# Altium project MU-RK3576J-MB.PrjPCB (part 13 of 13)
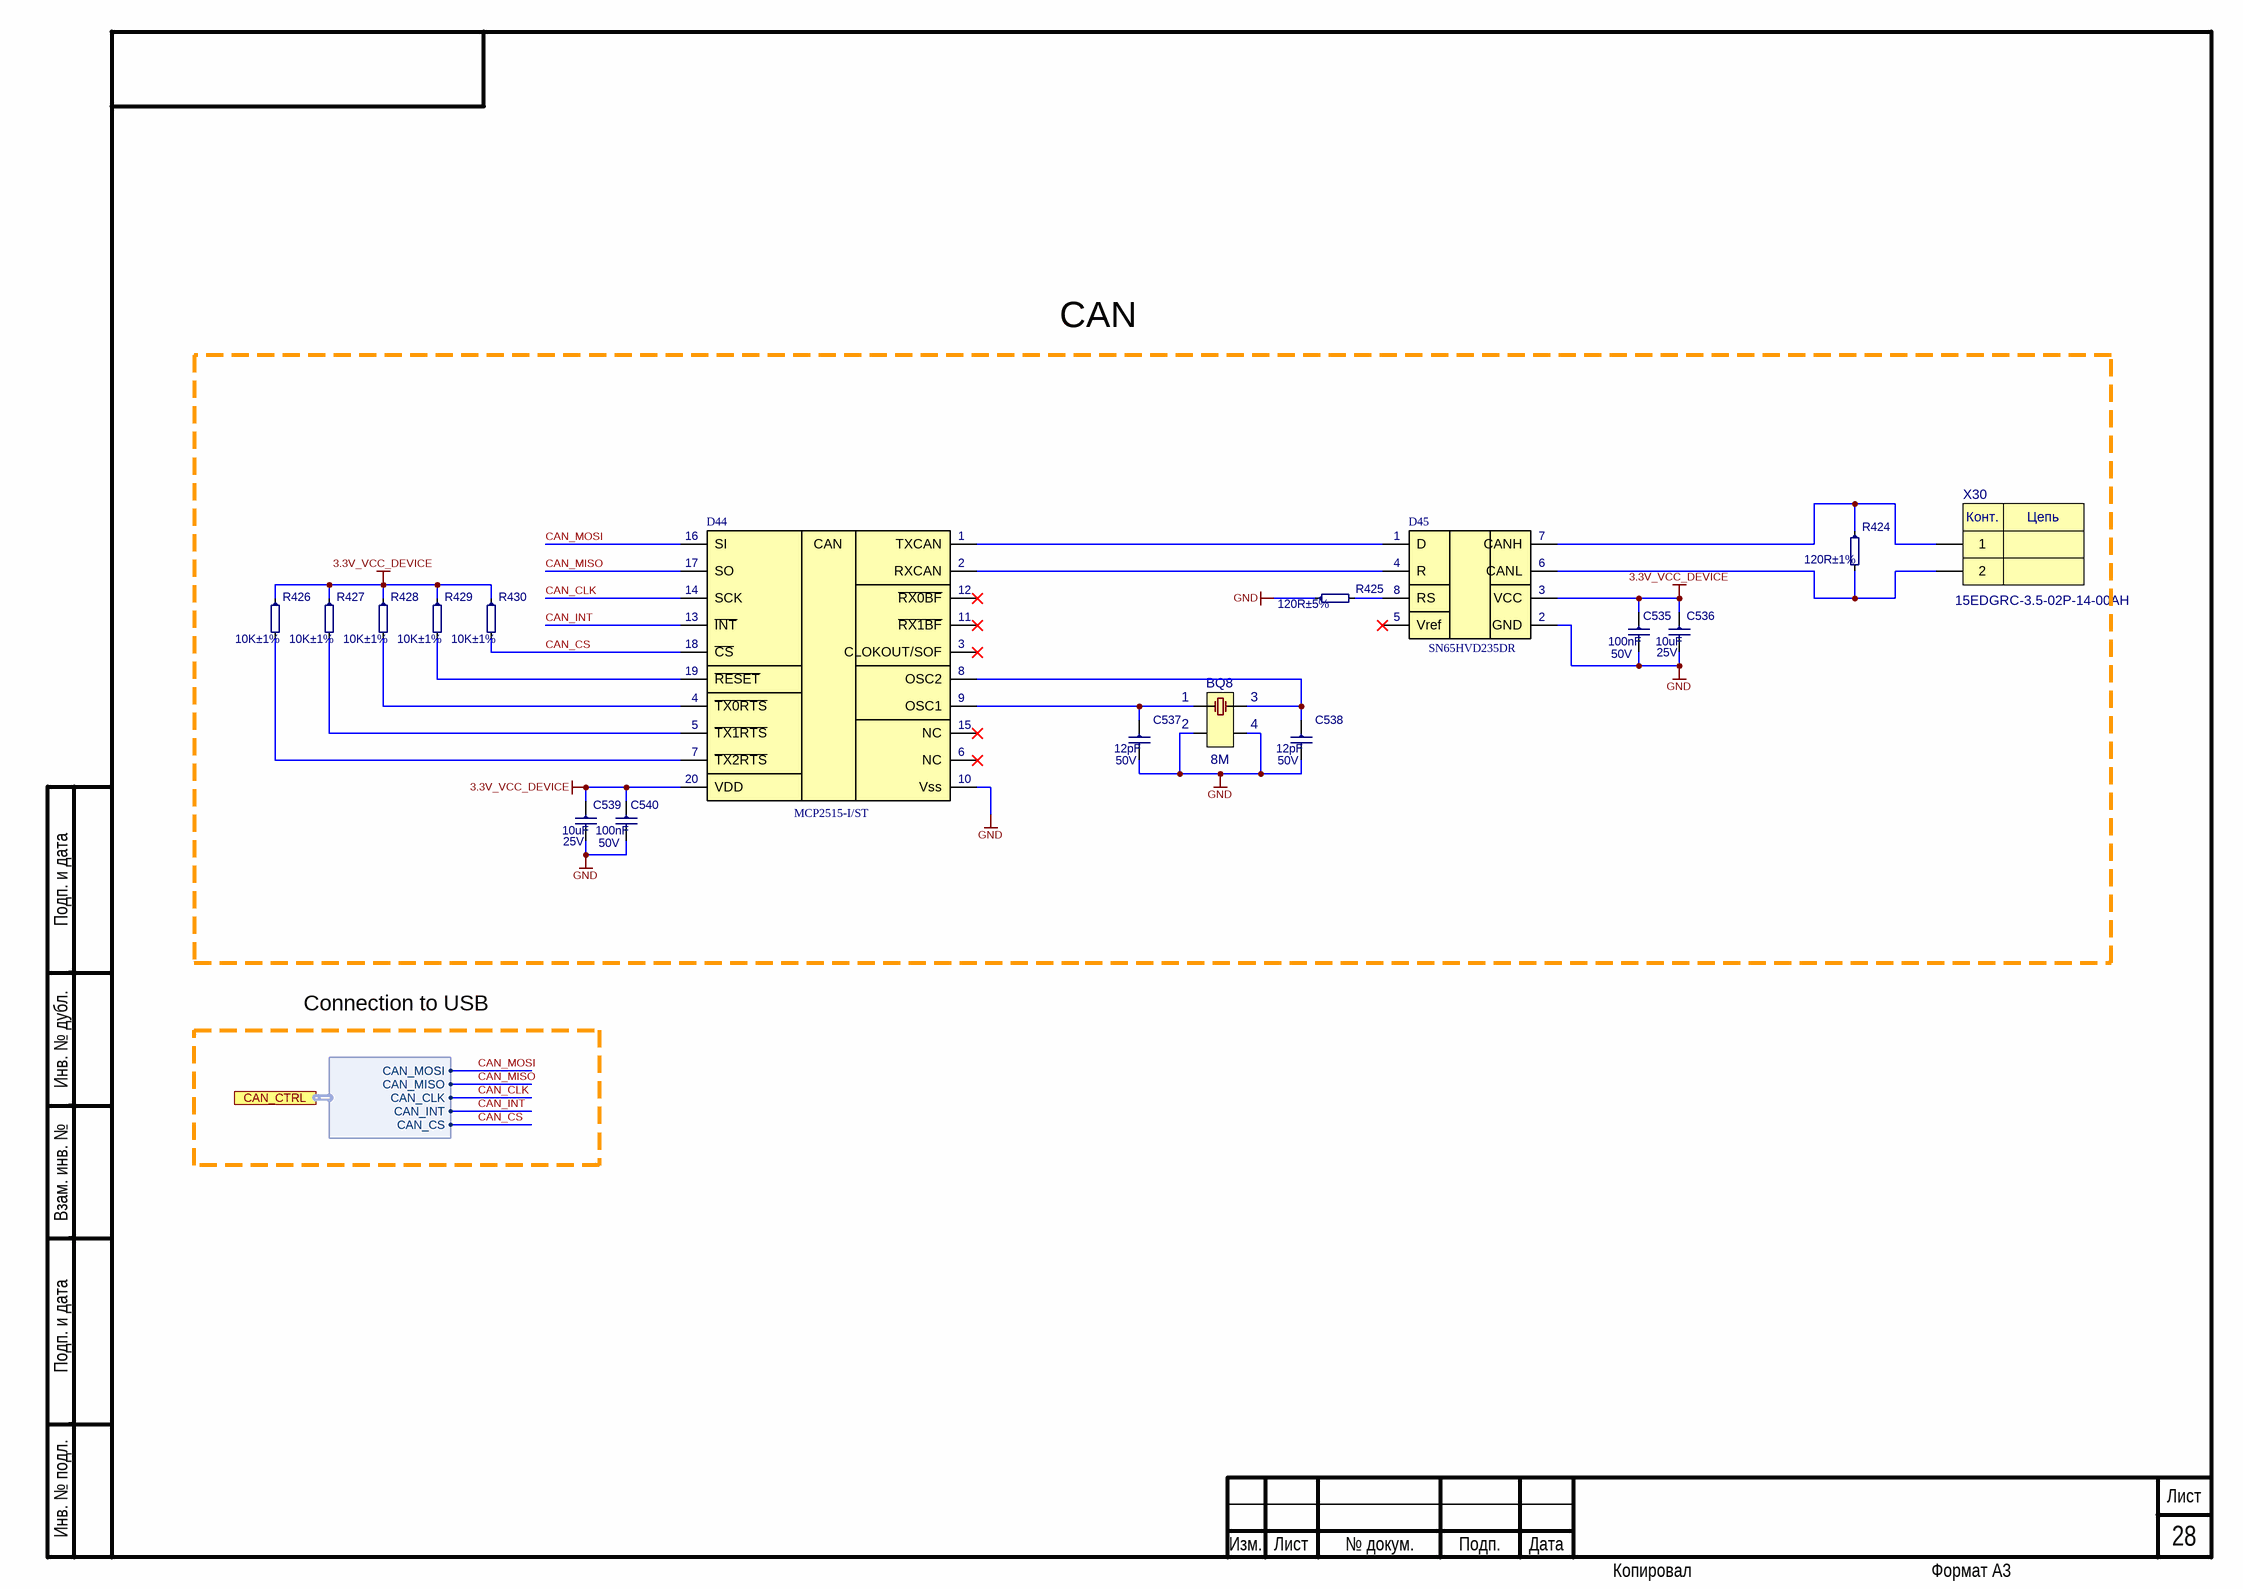
[diagram p134: CAN-FD.SchDoc]

## Nets that join several sheets
3.3V_VCC_DEVICE: PWR_MAIN (6 pins), LVDS_eDP (R241.1 R245.1 R405.1 VT7.2), INT_mPCIeX2_SIM (16 pins), CPU_PCIE_USB_HDMI_EXT_PCIEX2_mPCIeX2 (22 pins), AUDIO (15 pins), BMC (R268.1), CAN-FD (11 pins)
+1.2V_PCI: PWR_CORE (6 pins), CPU_PCIE_USB_HDMI_EXT_PCIEX2_mPCIeX2 (19 pins)
+1.5V_mPCIe: PWR_CORE (6 pins), INT_mPCIeX2_SIM (X7.6 X7.28 X7.48)
+3.3V_MCU: Flash_eMMC_MicroSD (14 pins), BMC (36 pins)
+12V_VCC_DEVICE: PWR_MAIN (6 pins), V-by-One (R472.1), LVDS_eDP (R243.1 R407.1), CPU_PCIE_USB_HDMI_EXT_PCIEX2_mPCIeX2 (16 pins), AUDIO (15 pins), BMC (R205.1), Peripheral (L17.1)
+VDC_IN_MAIN: PWR_DC_IN (14 pins), PWR_MAIN (26 pins), PWR_PoE_PD_1000BASE-T (VD49.1)
GND: PWR_DC_IN (40 pins), PWR_MAIN (69 pins), PWR_PMIC (59 pins), PWR_CPU (303 pins), PWR_PoE_PD_1000BASE-T (8 pins), PWR_CORE (56 pins), CPU_LPDDR4 (9 pins), CPU_GPIO (21 pins), IC_LPDDR4 (91 pins), Flash_eMMC_MicroSD (47 pins), HDMI (19 pins), CPU_MIPI_DSI_CSI (18 pins), V-by-One (86 pins), LVDS_eDP (27 pins), MIPI_x2CSI (18 pins), INT_mPCIeX2_SIM (56 pins), CPU_PCIE_USB_HDMI_EXT_PCIEX2_mPCIeX2 (97 pins), USB (21 pins), AUDIO (58 pins), BMC (62 pins), WIRELESS (28 pins), RGMII0_ETH_PHY (29 pins), CPU_ETH_RGMII1_SW (9 pins), Peripheral (45 pins), CAN-FD (11 pins)
SH: PWR_PoE_PD_1000BASE-T (10 pins), HDMI (C252.2 R105.2), INT_mPCIeX2_SIM (C282.2 C283.2 R143.2 R144.2), USB (C236.2 R95.2), Peripheral (C416.2 R112.2)
VCC1V1_RK628_HDMIRX: PWR_CORE (7 pins), V-by-One (C559.2 D47.D8 D47.E9)
VCC3V3_RK628_HDMIRX: PWR_CORE (L34.1 R369.2), V-by-One (C558.2 D47.H5 R444.1)
VCC5V0_DEVICE_S0: PWR_MAIN (6 pins), HDMI (5 pins), LVDS_eDP (R242.1 R406.1), CPU_PCIE_USB_HDMI_EXT_PCIEX2_mPCIeX2 (C585.2 D42.9 R438.2), USB (C231.2 C239.2 D15.5 D16.12), BMC (R203.1), Peripheral (VD43.2)
VCC5V0_SYS_S5: PWR_DC_IN (VT14.3), PWR_MAIN (7 pins), PWR_PMIC (28 pins), PWR_CORE (13 pins), BMC (C436.2 D30.1 D30.3 R270.1), Peripheral (R418.2)
VCC_1V1_NLDO_S3: PWR_PMIC (C83.1 C89.1 D3.9 D3.13), PWR_CORE (6 pins)
VCC_1V8_S0: PWR_CORE (C502.1 R367.1 VT27.2), CPU_ETH_RGMII1_SW (C542.2 D2.2A4 D2.2A5)
VCC_1V8_S3: PWR_MAIN (R53.2), PWR_PMIC (C106.1 C107.1 D3.5 L7.1), PWR_CORE (C501.1 VT27.3), CPU_GPIO (8 pins), IC_LPDDR4 (R6.1), Flash_eMMC_MicroSD (R64.2), BMC (C586.1 D43.OE D43.VCCA), WIRELESS (13 pins), CPU_ETH_RGMII1_SW (C546.2 D2.2B10)
VCC_2V0_PLDO_S3: PWR_PMIC (C59.1 D3.59), PWR_CORE (6 pins)
VCC_3V3_S0: PWR_MAIN (R38.1 R49.1 R60.1), PWR_CORE (C505.1 C506.1 D39.1), CPU_GPIO (C260.2 D2.2N3 R189.2 R191.2), HDMI (5 pins), MIPI_x2CSI (X22.22 X23.22), CPU_PCIE_USB_HDMI_EXT_PCIEX2_mPCIeX2 (C323.2 D2.2P7), BMC (R269.1), RGMII0_ETH_PHY (R293.1), CPU_ETH_RGMII1_SW (6 pins), Peripheral (HL10.2)
VCC_3V3_S3: PWR_MAIN (R54.1 R55.2 R56.2 VD7.2), PWR_PMIC (C108.1 C109.1 D3.24 L8.2), PWR_PoE_PD_1000BASE-T (R345.1), PWR_CORE (10 pins), CPU_GPIO (7 pins), Flash_eMMC_MicroSD (10 pins), WIRELESS (6 pins), CPU_ETH_RGMII1_SW (5 pins), Peripheral (7 pins)
VCCA1V1_RK628_HDMIRX: PWR_CORE (C511.1 L33.2), V-by-One (19 pins)
VCCA1V8_PLDO2_S0: PWR_PMIC (C61.2 D3.58), CPU_GPIO (C578.2 D2.2A10), Peripheral (5 pins)
VCCA3V3_RK628_HDMIRX: PWR_CORE (C519.1 L34.2), V-by-One (13 pins)
VCCA_1V8_S0: PWR_PMIC (C60.2 D3.60 R232.2), PWR_CPU (6 pins), CPU_LPDDR4 (C50.2 D2.2D2), CPU_GPIO (6 pins), CPU_MIPI_DSI_CSI (6 pins), CPU_PCIE_USB_HDMI_EXT_PCIEX2_mPCIeX2 (14 pins)
VCCIO_SD_S0: PWR_PMIC (C74.2 D3.65), CPU_GPIO (C259.2 D2.2A8)
VDD2_DDR_S3: PWR_PMIC (6 pins), IC_LPDDR4 (41 pins)
VDD_0V75_S3: PWR_PMIC (C84.2 D3.14), CPU_GPIO (C264.2 D2.2L2 D2.2L10)
VDD_CPU_BIG_S0: PWR_PMIC (7 pins), PWR_CPU (15 pins)
VDD_CPU_LIT_S0: PWR_PMIC (6 pins), PWR_CPU (9 pins)
VDD_DDR_S0: PWR_PMIC (6 pins), CPU_LPDDR4 (7 pins)
VDD_GPU_S0: PWR_PMIC (7 pins), PWR_CPU (9 pins)
VDD_LOGIC_S0: PWR_PMIC (7 pins), PWR_CPU (17 pins)
VDD_NPU_S0: PWR_PMIC (7 pins), PWR_CPU (9 pins)
VDDA_0V75_S0: PWR_PMIC (C95.2 D3.8), PWR_CPU (C154.2 D2.2G11), CPU_GPIO (C579.2 D2.2H11), CPU_MIPI_DSI_CSI (8 pins), CPU_PCIE_USB_HDMI_EXT_PCIEX2_mPCIeX2 (C320.2 D2.2P5)
VDDA_0V85_S0: PWR_PMIC (C90.2 D3.10), CPU_PCIE_USB_HDMI_EXT_PCIEX2_mPCIeX2 (7 pins)
VDDA_1V2_S0: PWR_PMIC (C69.2 D3.57), CPU_GPIO (C255.2 D2.2M3), CPU_MIPI_DSI_CSI (C402.1 D2.2M8)
VDDA_DDR_PLL_S0: PWR_PMIC (C85.2 D3.12), CPU_LPDDR4 (C49.2 D2.2C3)
VDDA_HDMI_S0: PWR_PMIC (C86.2 D3.11), CPU_PCIE_USB_HDMI_EXT_PCIEX2_mPCIeX2 (C327.2 C328.1 D2.2N11 D2.2P11)
VDDQ_DDR_CKE_S3: CPU_LPDDR4 (C51.2 D2.2B2), IC_LPDDR4 (R488.2)
VDDQ_DDR_S0: PWR_PMIC (6 pins), CPU_LPDDR4 (14 pins), IC_LPDDR4 (R4.1)
+5V_ON_OFF: PWR_DC_IN (R151.1), BMC (D28.66)
A_DRAM_CA0: CPU_LPDDR4 (D2.T1), IC_LPDDR4 (D1.H2)
A_DRAM_CA1: CPU_LPDDR4 (D2.1N1), IC_LPDDR4 (D1.J2)
A_DRAM_CA2: CPU_LPDDR4 (D2.1R3), IC_LPDDR4 (D1.H9)
A_DRAM_CA3: CPU_LPDDR4 (D2.1T2), IC_LPDDR4 (D1.H10)
A_DRAM_CA4: CPU_LPDDR4 (D2.1M5), IC_LPDDR4 (D1.H11)
A_DRAM_CA5: CPU_LPDDR4 (D2.1P5), IC_LPDDR4 (D1.J11)
A_DRAM_CKE0: CPU_LPDDR4 (D2.1N3), IC_LPDDR4 (D1.J4)
A_DRAM_CKE1: CPU_LPDDR4 (D2.1N5), IC_LPDDR4 (D1.J5)
A_DRAM_CLK_N: CPU_LPDDR4 (D2.P1), IC_LPDDR4 (D1.J9)
A_DRAM_CLK_P: CPU_LPDDR4 (D2.1L1), IC_LPDDR4 (D1.J8)
A_DRAM_CS0: CPU_LPDDR4 (D2.1R4), IC_LPDDR4 (D1.H4)
A_DRAM_CS1: CPU_LPDDR4 (D2.1T4), IC_LPDDR4 (D1.H3)
A_DRAM_DATA0: CPU_LPDDR4 (D2.W1), IC_LPDDR4 (D1.B2)
A_DRAM_DATA1: CPU_LPDDR4 (D2.1T1), IC_LPDDR4 (D1.C2)
A_DRAM_DATA2: CPU_LPDDR4 (D2.1P1), IC_LPDDR4 (D1.E2)
A_DRAM_DATA3: CPU_LPDDR4 (D2.U1), IC_LPDDR4 (D1.F2)
A_DRAM_DATA4: CPU_LPDDR4 (D2.1V3), IC_LPDDR4 (D1.F4)
A_DRAM_DATA5: CPU_LPDDR4 (D2.1W4), IC_LPDDR4 (D1.E4)
A_DRAM_DATA6: CPU_LPDDR4 (D2.AC1), IC_LPDDR4 (D1.C4)
A_DRAM_DATA7: CPU_LPDDR4 (D2.AB1), IC_LPDDR4 (D1.B4)
A_DRAM_DATA8: CPU_LPDDR4 (D2.AF1), IC_LPDDR4 (D1.B11)
A_DRAM_DATA9: CPU_LPDDR4 (D2.1AB1), IC_LPDDR4 (D1.C11)
A_DRAM_DATA10: CPU_LPDDR4 (D2.1AD1), IC_LPDDR4 (D1.E11)
A_DRAM_DATA11: CPU_LPDDR4 (D2.AH1), IC_LPDDR4 (D1.F11)
A_DRAM_DATA12: CPU_LPDDR4 (D2.1Y1), IC_LPDDR4 (D1.F9)
A_DRAM_DATA13: CPU_LPDDR4 (D2.1W2), IC_LPDDR4 (D1.E9)
A_DRAM_DATA14: CPU_LPDDR4 (D2.1AA3), IC_LPDDR4 (D1.C9)
A_DRAM_DATA15: CPU_LPDDR4 (D2.1AA1), IC_LPDDR4 (D1.B9)
A_DRAM_DATALINE.A_DRAM_DMI0: CPU_LPDDR4 (D2.1V1), IC_LPDDR4 (D1.C3)
A_DRAM_DATALINE.A_DRAM_DMI1: CPU_LPDDR4 (D2.AE1), IC_LPDDR4 (D1.C10)
A_DRAM_DATALINE.A_DRAM_DQS0_N: CPU_LPDDR4 (D2.Y1), IC_LPDDR4 (D1.E3)
A_DRAM_DATALINE.A_DRAM_DQS0_P: CPU_LPDDR4 (D2.1U1), IC_LPDDR4 (D1.D3)
A_DRAM_DATALINE.A_DRAM_DQS1_N: CPU_LPDDR4 (D2.1AB3), IC_LPDDR4 (D1.E10)
A_DRAM_DATALINE.A_DRAM_DQS1_P: CPU_LPDDR4 (D2.1AB4), IC_LPDDR4 (D1.D10)
AMP_CTRL.AMP_MUTE: AUDIO (R228.2), CPU_ETH_RGMII1_SW (D2.1D13)
AMP_CTRL.AMP_RST: AUDIO (R217.1 R218.1), CPU_ETH_RGMII1_SW (D2.B6)
ASM_I2C.RK_ASM_I2C_SCL: CPU_PCIE_USB_HDMI_EXT_PCIEX2_mPCIeX2 (X19.A2), CPU_ETH_RGMII1_SW (D2.1A24)
ASM_I2C.RK_ASM_I2C_SDA: CPU_PCIE_USB_HDMI_EXT_PCIEX2_mPCIeX2 (X19.A3), CPU_ETH_RGMII1_SW (D2.C28)
B_DRAM_CA0: CPU_LPDDR4 (D2.L1), IC_LPDDR4 (D1.R2)
B_DRAM_CA1: CPU_LPDDR4 (D2.1J1), IC_LPDDR4 (D1.P2)
B_DRAM_CA2: CPU_LPDDR4 (D2.1J3), IC_LPDDR4 (D1.R9)
B_DRAM_CA3: CPU_LPDDR4 (D2.1G2), IC_LPDDR4 (D1.R10)
B_DRAM_CA4: CPU_LPDDR4 (D2.1F4), IC_LPDDR4 (D1.R11)
B_DRAM_CA5: CPU_LPDDR4 (D2.1K5), IC_LPDDR4 (D1.P11)
B_DRAM_CKE0: CPU_LPDDR4 (D2.1K2), IC_LPDDR4 (D1.P4)
B_DRAM_CKE1: CPU_LPDDR4 (D2.1M3), IC_LPDDR4 (D1.P5)
B_DRAM_CLK_N: CPU_LPDDR4 (D2.N1), IC_LPDDR4 (D1.P9)
B_DRAM_CLK_P: CPU_LPDDR4 (D2.1K1), IC_LPDDR4 (D1.P8)
B_DRAM_CS0: CPU_LPDDR4 (D2.1J5), IC_LPDDR4 (D1.R4)
B_DRAM_CS1: CPU_LPDDR4 (D2.1K4), IC_LPDDR4 (D1.R3)
B_DRAM_DATA0: CPU_LPDDR4 (D2.1D2), IC_LPDDR4 (D1.AA2)
B_DRAM_DATA1: CPU_LPDDR4 (D2.1F2), IC_LPDDR4 (D1.Y2)
B_DRAM_DATA2: CPU_LPDDR4 (D2.1G1), IC_LPDDR4 (D1.V2)
B_DRAM_DATA3: CPU_LPDDR4 (D2.K1), IC_LPDDR4 (D1.U2)
B_DRAM_DATA4: CPU_LPDDR4 (D2.1C3), IC_LPDDR4 (D1.U4)
B_DRAM_DATA5: CPU_LPDDR4 (D2.1B3), IC_LPDDR4 (D1.V4)
B_DRAM_DATA6: CPU_LPDDR4 (D2.A5), IC_LPDDR4 (D1.Y4)
B_DRAM_DATA7: CPU_LPDDR4 (D2.G1), IC_LPDDR4 (D1.AA4)
B_DRAM_DATA8: CPU_LPDDR4 (D2.1A1), IC_LPDDR4 (D1.AA11)
B_DRAM_DATA9: CPU_LPDDR4 (D2.B1), IC_LPDDR4 (D1.Y11)
B_DRAM_DATA10: CPU_LPDDR4 (D2.B2), IC_LPDDR4 (D1.V11)
B_DRAM_DATA11: CPU_LPDDR4 (D2.A2), IC_LPDDR4 (D1.U11)
B_DRAM_DATA12: CPU_LPDDR4 (D2.1E1), IC_LPDDR4 (D1.U9)
B_DRAM_DATA13: CPU_LPDDR4 (D2.1C1), IC_LPDDR4 (D1.V9)
B_DRAM_DATA14: CPU_LPDDR4 (D2.E1), IC_LPDDR4 (D1.Y9)
B_DRAM_DATA15: CPU_LPDDR4 (D2.D1), IC_LPDDR4 (D1.AA9)
B_DRAM_DATALINE.B_DRAM_DMI0: CPU_LPDDR4 (D2.B4), IC_LPDDR4 (D1.Y3)
B_DRAM_DATALINE.B_DRAM_DMI1: CPU_LPDDR4 (D2.1B1), IC_LPDDR4 (D1.Y10)
B_DRAM_DATALINE.B_DRAM_DQS0_N: CPU_LPDDR4 (D2.1F1), IC_LPDDR4 (D1.V3)
B_DRAM_DATALINE.B_DRAM_DQS0_P: CPU_LPDDR4 (D2.H1), IC_LPDDR4 (D1.W3)
B_DRAM_DATALINE.B_DRAM_DQS1_N: CPU_LPDDR4 (D2.B3), IC_LPDDR4 (D1.V10)
B_DRAM_DATALINE.B_DRAM_DQS1_P: CPU_LPDDR4 (D2.A3), IC_LPDDR4 (D1.W10)
BMC_UART.BMC_UART_RX: BMC (D43.A1), CPU_ETH_RGMII1_SW (D2.C29)
BMC_UART.BMC_UART_TX: BMC (D43.A2), CPU_ETH_RGMII1_SW (D2.1D22)
BT_EN_HOST: WIRELESS (R397.1), CPU_ETH_RGMII1_SW (D2.1C22)
BT_UART.BT_UART_CTS: WIRELESS (A2.41), CPU_ETH_RGMII1_SW (D2.1C23)
BT_UART.BT_UART_RTS: WIRELESS (A2.44), CPU_ETH_RGMII1_SW (D2.B29)
BT_UART.BT_UART_RX: WIRELESS (A2.42), CPU_ETH_RGMII1_SW (D2.B28)
BT_UART.BT_UART_TX: WIRELESS (A2.43), CPU_ETH_RGMII1_SW (D2.1B23)
BT_WAKE: CPU_GPIO (D2.1P23), WIRELESS (R399.2 VT33.3)
CAN_CLK: CPU_ETH_RGMII1_SW (D2.1E12), CAN-FD (D44.14)
CAN_CS: CPU_ETH_RGMII1_SW (D2.1E7), CAN-FD (D44.18 R430.2)
CAN_CTRL.CAN_INT: CPU_ETH_RGMII1_SW (D2.1B7), CAN-FD (D44.13)
CAN_CTRL.CAN_MISO: CPU_ETH_RGMII1_SW (D2.1D10), CAN-FD (D44.17)
CAN_CTRL.CAN_MOSI: CPU_ETH_RGMII1_SW (D2.1C10), CAN-FD (D44.16)
DAC_CTRL.I2S_BCK: AUDIO (D23.21), CPU_ETH_RGMII1_SW (D2.1D6)
DAC_CTRL.I2S_LRCK: AUDIO (D23.23), CPU_ETH_RGMII1_SW (D2.1B6)
DAC_CTRL.I2S_OUT: AUDIO (D23.22), CPU_ETH_RGMII1_SW (D2.A7)
DAC_CTRL.I2S_SCK: AUDIO (R206.1), CPU_ETH_RGMII1_SW (D2.1C6)
DAC_CTRL.PCM_I2C_SCL: AUDIO (D23.12 R195.2), CPU_ETH_RGMII1_SW (D2.1A4)
DAC_CTRL.PCM_I2C_SDA: AUDIO (D23.11 R196.2), CPU_ETH_RGMII1_SW (D2.B8)
DEBUG.UART0_RX_M0_DEBUG: CPU_GPIO (R244.1), Peripheral (D26.8)
DEBUG.UART0_TX_M0_DEBUG: CPU_GPIO (R238.1), Peripheral (D26.9)
DRAM_ADDR_CTRL_CK.DRAM_RESETn: CPU_LPDDR4 (D2.1U5), IC_LPDDR4 (D1.T11 R2.1)
DWLD_DIS.eMMC_FSPI_DIS: Flash_eMMC_MicroSD (R68.2), BMC (D28.80)
EDP_BL_EN: CPU_GPIO (D2.1Y22), LVDS_eDP (X29.27)
EDP_BL_PWM: CPU_GPIO (D2.1AA23), LVDS_eDP (X29.28)
EDP_CTRL.EDP_HPD: CPU_GPIO (D2.AC28), LVDS_eDP (X29.22)
EDP_CTRL.EDP_VCC_EN: CPU_GPIO (D2.1W23), LVDS_eDP (R246.1)
EEPROM_CTRL.I2C6_SCL_M3: CPU_GPIO (D2.1AE1), Flash_eMMC_MicroSD (D14.1 R82.2)
EEPROM_CTRL.I2C6_SDA_M3: CPU_GPIO (D2.AJ1), Flash_eMMC_MicroSD (D14.3 R81.2)
EEPROM_WP.EEPROM_WP_MCU_0: Flash_eMMC_MicroSD (R84.1 R87.2 VT3.2), BMC (D28.85)
EEPROM_WP.EEPROM_WP_MCU_1: Flash_eMMC_MicroSD (R86.2), BMC (D28.86)
eMMC_CLKOUT: CPU_GPIO (D2.1G23), Flash_eMMC_MicroSD (R66.1)
eMMC_CMD: CPU_GPIO (D2.1F22), Flash_eMMC_MicroSD (D12.M5 R65.2)
eMMC_D0: CPU_GPIO (D2.E28), Flash_eMMC_MicroSD (D12.A3 R63.2 VT1.3)
eMMC_D1: CPU_GPIO (D2.E29), Flash_eMMC_MicroSD (D12.A4)
eMMC_D2: CPU_GPIO (D2.1C24), Flash_eMMC_MicroSD (D12.A5)
eMMC_D3: CPU_GPIO (D2.F28), Flash_eMMC_MicroSD (D12.B2)
eMMC_D4: CPU_GPIO (D2.1D24), Flash_eMMC_MicroSD (D12.B3)
eMMC_D5: CPU_GPIO (D2.G28), Flash_eMMC_MicroSD (D12.B4)
eMMC_D6: CPU_GPIO (D2.D28), Flash_eMMC_MicroSD (D12.B5)
eMMC_D7: CPU_GPIO (D2.1B24), Flash_eMMC_MicroSD (D12.B6)
eMMC_DATA_STROBE: CPU_GPIO (D2.1F23), Flash_eMMC_MicroSD (D12.H5 R70.1)
eMMC_RSTn: CPU_GPIO (D2.1D23), Flash_eMMC_MicroSD (D12.K5 R67.2)
EN_MUX_GMAC1: BMC (D28.81), CPU_ETH_RGMII1_SW (D46.2 R439.1)
FAN_PWM: CPU_GPIO (D2.AK1), Peripheral (R237.1)
GMAC0_RXCLK: RGMII0_ETH_PHY (R303.2), CPU_ETH_RGMII1_SW (D2.1A12)
GMAC0_RXD0: RGMII0_ETH_PHY (R294.2), CPU_ETH_RGMII1_SW (D2.A13)
GMAC0_RXD1: RGMII0_ETH_PHY (R297.2), CPU_ETH_RGMII1_SW (D2.1A11)
GMAC0_RXD2: RGMII0_ETH_PHY (R300.2), CPU_ETH_RGMII1_SW (D2.B12)
GMAC0_RXD3: RGMII0_ETH_PHY (R302.2), CPU_ETH_RGMII1_SW (D2.1A10)
GMAC0_RXDV_CRS: RGMII0_ETH_PHY (R304.2), CPU_ETH_RGMII1_SW (D2.B13)
GMAC0_TXCLK: RGMII0_ETH_PHY (R316.2), CPU_ETH_RGMII1_SW (D2.B11)
GMAC0_TXD0: RGMII0_ETH_PHY (R309.2), CPU_ETH_RGMII1_SW (D2.1A9)
GMAC0_TXD1: RGMII0_ETH_PHY (R310.2), CPU_ETH_RGMII1_SW (D2.B10)
GMAC0_TXD2: RGMII0_ETH_PHY (R311.2), CPU_ETH_RGMII1_SW (D2.1A8)
GMAC0_TXD3: RGMII0_ETH_PHY (R314.2), CPU_ETH_RGMII1_SW (D2.B9)
GMAC0_TXEN: RGMII0_ETH_PHY (R315.2), CPU_ETH_RGMII1_SW (D2.A11)
GMAC1_MD.GMAC1_MDC: CPU_PCIE_USB_HDMI_EXT_PCIEX2_mPCIeX2 (X17.26 X18.B8), CPU_ETH_RGMII1_SW (R437.1)
GMAC1_MD.GMAC1_MDIO: CPU_PCIE_USB_HDMI_EXT_PCIEX2_mPCIeX2 (X17.24 X18.B9), CPU_ETH_RGMII1_SW (D2.1B15)
GMAC1_MD.PHY1_RSTn: CPU_PCIE_USB_HDMI_EXT_PCIEX2_mPCIeX2 (X17.20 X18.B10), CPU_ETH_RGMII1_SW (D2.A19)
GPS_CTRL.GPS_MODE: WIRELESS (R379.2), CPU_ETH_RGMII1_SW (D2.B19)
GPS_CTRL.GPS_ON: WIRELESS (R384.1), CPU_ETH_RGMII1_SW (D2.1A18)
GPS_CTRL.GPS_PPS: WIRELESS (A1.4), CPU_ETH_RGMII1_SW (D2.B21)
GPS_CTRL.GPS_RST: WIRELESS (R380.2), CPU_ETH_RGMII1_SW (D2.1B16)
GPS_CTRL.GPS_UART_RX: WIRELESS (A1.3 R376.2), CPU_ETH_RGMII1_SW (D2.B22)
GPS_CTRL.GPS_UART_TX: WIRELESS (A1.2 R377.2), CPU_ETH_RGMII1_SW (D2.B20)
HARD_RESETn: PWR_MAIN (D6.3), BMC (VT10.3), Peripheral (R416.1 R418.1)
HDMI/EDP_TX0_N: LVDS_eDP (C533.1), CPU_PCIE_USB_HDMI_EXT_PCIEX2_mPCIeX2 (D2.AK27)
HDMI/EDP_TX0_P: LVDS_eDP (C534.1), CPU_PCIE_USB_HDMI_EXT_PCIEX2_mPCIeX2 (D2.1AE24)
HDMI/EDP_TX1_N: LVDS_eDP (C531.1), CPU_PCIE_USB_HDMI_EXT_PCIEX2_mPCIeX2 (D2.AL28)
HDMI/EDP_TX1_P: LVDS_eDP (C532.1), CPU_PCIE_USB_HDMI_EXT_PCIEX2_mPCIeX2 (D2.AK28)
HDMI/EDP_TX2_N: LVDS_eDP (C529.1), CPU_PCIE_USB_HDMI_EXT_PCIEX2_mPCIeX2 (D2.AK29)
HDMI/EDP_TX2_P: LVDS_eDP (C530.1), CPU_PCIE_USB_HDMI_EXT_PCIEX2_mPCIeX2 (D2.AJ28)
HDMI/EDP_TX_SBD_N: LVDS_eDP (C574.1), CPU_PCIE_USB_HDMI_EXT_PCIEX2_mPCIeX2 (D2.2U12)
HDMI/EDP_TX_SBD_P: LVDS_eDP (C573.1), CPU_PCIE_USB_HDMI_EXT_PCIEX2_mPCIeX2 (D2.2T12)
HDMI/EDP_TXC_N: LVDS_eDP (C527.1), CPU_PCIE_USB_HDMI_EXT_PCIEX2_mPCIeX2 (D2.AK26)
HDMI/EDP_TXC_P: LVDS_eDP (C528.1), CPU_PCIE_USB_HDMI_EXT_PCIEX2_mPCIeX2 (D2.AL26)
HDMI_CTRL_VBX.HDMI_TX_CEC: CPU_GPIO (D2.AK3), V-by-One (D47.K9)
HDMI_CTRL_VBX.HDMI_TX_HPDIN: CPU_GPIO (D2.AK2), V-by-One (R240.1)
HDMI_CTRL_VBX.HDMI_TX_SCL: CPU_GPIO (D2.1AE2 R191.1), V-by-One (D47.M8)
HDMI_CTRL_VBX.HDMI_TX_SDA: CPU_GPIO (D2.AL2 R189.1), V-by-One (D47.L8)
HDMI_TX0_N: HDMI (C247.2), V-by-One (R450.2)
HDMI_TX0_P: HDMI (C246.2), V-by-One (R452.2)
HDMI_TX1_N: HDMI (C245.2), V-by-One (R448.2)
HDMI_TX1_P: HDMI (C244.2), V-by-One (R449.2)
HDMI_TX2_N: HDMI (C243.2), V-by-One (R445.2)
HDMI_TX2_P: HDMI (C242.2), V-by-One (R446.2)
HDMI_TX_CEC: HDMI (R100.2 VT6.2), V-by-One (D47.M2)
HDMI_TX_HPD: HDMI (R101.1), V-by-One (D47.L2)
HDMI_TX_SCL: HDMI (R96.2 VT4.2), V-by-One (D47.L1)
HDMI_TX_SDA: HDMI (R98.2 VT5.2), V-by-One (D47.K1)
HDMI_TXCLK_N: HDMI (C249.2), V-by-One (R453.2)
HDMI_TXCLK_P: HDMI (C248.2), V-by-One (R455.2)
I2C0_SCL: CPU_GPIO (D2.AB28 R108.1), CPU_PCIE_USB_HDMI_EXT_PCIEX2_mPCIeX2 (X16.30)
I2C0_SDA: CPU_GPIO (D2.1V24 R109.1), CPU_PCIE_USB_HDMI_EXT_PCIEX2_mPCIeX2 (X16.32)
I2C1_SCL: CPU_GPIO (D2.AD28), CPU_PCIE_USB_HDMI_EXT_PCIEX2_mPCIeX2 (X17.30)
I2C1_SCL_M0_RK806: PWR_PMIC (D3.17), CPU_GPIO (D2.1T22 R124.1)
I2C1_SDA: CPU_GPIO (D2.AD29), CPU_PCIE_USB_HDMI_EXT_PCIEX2_mPCIeX2 (X17.32)
I2C1_SDA_M0_RK806: PWR_PMIC (D3.15), CPU_GPIO (D2.1T23 R126.1)
I2C2_SCL_M0_CC_RTC: PWR_MAIN (D10.6 R55.1), CPU_GPIO (D2.1W24)
I2C2_SDA_M0_CC_RTC: PWR_MAIN (D10.5 R56.1), CPU_GPIO (D2.AB29)
I2C4_SCL_M3_MIPI_CSI0: MIPI_x2CSI (X23.20), CPU_ETH_RGMII1_SW (D2.1E9)
I2C4_SDA_M3_MIPI_CSI0: MIPI_x2CSI (X23.21), CPU_ETH_RGMII1_SW (D2.1D12)
I2C5_SCL_M3_MIPI_CSI1: MIPI_x2CSI (X22.20), CPU_ETH_RGMII1_SW (D2.1D9)
I2C5_SDA_M3_MIPI_CSI1: MIPI_x2CSI (X22.21), CPU_ETH_RGMII1_SW (D2.1B10)
IR_CTRL.IR_GREEN: CPU_ETH_RGMII1_SW (D2.1D18), Peripheral (R481.2)
IR_CTRL.IR_RED: CPU_ETH_RGMII1_SW (D2.1A17), Peripheral (R479.2)
IR_CTRL.Remote_ in: CPU_ETH_RGMII1_SW (D2.1A19), Peripheral (R485.2)
IR_CTRL.Remote_out: CPU_ETH_RGMII1_SW (D2.1A20), Peripheral (R484.2)
LED_B: BMC (D28.65), Peripheral (R665.1 V86.1)
LED_G: BMC (D28.64), Peripheral (R666.1 VT85.1)
LED_R: BMC (D28.63), Peripheral (R667.1 VT84.1)
LVDS0_CLK_N: V-by-One (D47.E1), LVDS_eDP (X35.15)
LVDS0_CLK_P: V-by-One (D47.E2), LVDS_eDP (X35.16)
LVDS0_D0_GVI_D0_N: V-by-One (D47.G1 X31.24), LVDS_eDP (X35.7)
LVDS0_D0_GVI_D0_P: V-by-One (D47.G2 X31.23), LVDS_eDP (X35.8)
LVDS0_D1_GVI_D1_N: V-by-One (D47.F1 X31.21), LVDS_eDP (X35.9)
LVDS0_D1_GVI_D1_P: V-by-One (D47.F2 X31.20), LVDS_eDP (X35.10)
LVDS0_D2_GVI_D2_N: V-by-One (D47.D1 X31.18), LVDS_eDP (X35.11)
LVDS0_D2_GVI_D2_P: V-by-One (D47.D2 X31.17), LVDS_eDP (X35.12)
LVDS0_D3_GVI_D3_N: V-by-One (D47.C1 X31.15), LVDS_eDP (X35.17)
LVDS0_D3_GVI_D3_P: V-by-One (D47.C2 X31.14), LVDS_eDP (X35.18)
LVDS1_CLK_N: V-by-One (D47.B4), LVDS_eDP (X35.27)
LVDS1_CLK_P: V-by-One (D47.A4), LVDS_eDP (X35.28)
LVDS1_D0_GVI_D4_N: V-by-One (D47.B2 X31.12), LVDS_eDP (X35.19)
LVDS1_D0_GVI_D4_P: V-by-One (D47.A2 X31.11), LVDS_eDP (X35.20)
LVDS1_D1_GVI_D5_N: V-by-One (D47.B3 X31.9), LVDS_eDP (X35.21)
LVDS1_D1_GVI_D5_P: V-by-One (D47.A3 X31.8), LVDS_eDP (X35.22)
LVDS1_D2_GVI_D6_N: V-by-One (D47.B5 X31.6), LVDS_eDP (X35.23)
LVDS1_D2_GVI_D6_P: V-by-One (D47.A5 X31.5), LVDS_eDP (X35.24)
LVDS1_D3_GVI_D7_N: V-by-One (D47.B6 X31.3), LVDS_eDP (X35.29)
LVDS1_D3_GVI_D7_P: V-by-One (D47.A6 X31.2), LVDS_eDP (X35.30)
MINI1PCIE20_REFCLK_N: INT_mPCIeX2_SIM (X7.11), CPU_PCIE_USB_HDMI_EXT_PCIEX2_mPCIeX2 (D21.19)
MINI1PCIE20_REFCLK_P: INT_mPCIeX2_SIM (X7.13), CPU_PCIE_USB_HDMI_EXT_PCIEX2_mPCIeX2 (D21.18)
MINI1PCIE20_RX_N: INT_mPCIeX2_SIM (X7.23), CPU_PCIE_USB_HDMI_EXT_PCIEX2_mPCIeX2 (D21.14)
MINI1PCIE20_RX_P: INT_mPCIeX2_SIM (X7.25), CPU_PCIE_USB_HDMI_EXT_PCIEX2_mPCIeX2 (D21.13)
MINI1PCIE20_TX_N: INT_mPCIeX2_SIM (X7.31), CPU_PCIE_USB_HDMI_EXT_PCIEX2_mPCIeX2 (C315.2)
MINI1PCIE20_TX_P: INT_mPCIeX2_SIM (X7.33), CPU_PCIE_USB_HDMI_EXT_PCIEX2_mPCIeX2 (C314.2)
MIPI_CSI0_CTRL.MIPI_CSI0_PDN1_H: MIPI_x2CSI (X23.17), CPU_ETH_RGMII1_SW (D2.1B9)
MIPI_CSI0_CTRL.MIPI_CSI0_PDN2_H: MIPI_x2CSI (X23.18), CPU_ETH_RGMII1_SW (D2.1D7)
MIPI_CSI1_CTRL.MIPI_CSI1_PDN1_H: MIPI_x2CSI (X22.17), CPU_ETH_RGMII1_SW (D2.1C12)
MIPI_CSI1_CTRL.MIPI_CSI1_PDN2_H: MIPI_x2CSI (X22.18), CPU_ETH_RGMII1_SW (D2.B7)
MIPI_DPHY_CSI0_RX_CLK_N: CPU_MIPI_DSI_CSI (D2.AL22), MIPI_x2CSI (X23.8)
MIPI_DPHY_CSI0_RX_CLK_P: CPU_MIPI_DSI_CSI (D2.AK22), MIPI_x2CSI (X23.9)
MIPI_DPHY_CSI0_RX_D0_N: CPU_MIPI_DSI_CSI (D2.AL20), MIPI_x2CSI (X23.2)
MIPI_DPHY_CSI0_RX_D0_P: CPU_MIPI_DSI_CSI (D2.AK20), MIPI_x2CSI (X23.3)
MIPI_DPHY_CSI0_RX_D1_N: CPU_MIPI_DSI_CSI (D2.AL21), MIPI_x2CSI (X23.5)
MIPI_DPHY_CSI0_RX_D1_P: CPU_MIPI_DSI_CSI (D2.AK21), MIPI_x2CSI (X23.6)
MIPI_DPHY_CSI0_RX_D2_N: CPU_MIPI_DSI_CSI (D2.AL23), MIPI_x2CSI (X23.11)
MIPI_DPHY_CSI0_RX_D2_P: CPU_MIPI_DSI_CSI (D2.AK23), MIPI_x2CSI (X23.12)
MIPI_DPHY_CSI0_RX_D3_N: CPU_MIPI_DSI_CSI (D2.AL24), MIPI_x2CSI (X23.14)
MIPI_DPHY_CSI0_RX_D3_P: CPU_MIPI_DSI_CSI (D2.AK24), MIPI_x2CSI (X23.15)
MIPI_DPHY_CSI1_RX_CLK_N: CPU_MIPI_DSI_CSI (D2.1AC23), MIPI_x2CSI (X22.14)
MIPI_DPHY_CSI1_RX_CLK_P: CPU_MIPI_DSI_CSI (D2.1AC22), MIPI_x2CSI (X22.15)
MIPI_DPHY_CSI1_RX_D0_N: CPU_MIPI_DSI_CSI (D2.AE28), MIPI_x2CSI (X22.3)
MIPI_DPHY_CSI1_RX_D0_P: CPU_MIPI_DSI_CSI (D2.AE29), MIPI_x2CSI (X22.2)
MIPI_DPHY_CSI1_RX_D1_N: CPU_MIPI_DSI_CSI (D2.AF28), MIPI_x2CSI (X22.6)
MIPI_DPHY_CSI1_RX_D1_P: CPU_MIPI_DSI_CSI (D2.AF29), MIPI_x2CSI (X22.5)
MIPI_DPHY_CSI1_RX_D2_N: CPU_MIPI_DSI_CSI (D2.AG28), MIPI_x2CSI (X22.9)
MIPI_DPHY_CSI1_RX_D2_P: CPU_MIPI_DSI_CSI (D2.AG29), MIPI_x2CSI (X22.8)
MIPI_DPHY_CSI1_RX_D3_N: CPU_MIPI_DSI_CSI (D2.AH28), MIPI_x2CSI (X22.12)
MIPI_DPHY_CSI1_RX_D3_P: CPU_MIPI_DSI_CSI (D2.AH29), MIPI_x2CSI (X22.11)
mPCIe3_Detect: CPU_PCIE_USB_HDMI_EXT_PCIEX2_mPCIeX2 (X16.48), BMC (D28.57)
mPCIe3_PWR_ON: CPU_PCIE_USB_HDMI_EXT_PCIEX2_mPCIeX2 (R160.1), BMC (D28.58)
mPCIe4_Detect: CPU_PCIE_USB_HDMI_EXT_PCIEX2_mPCIeX2 (X17.28), BMC (D28.56)
mPCIe4_PWR_ON: CPU_PCIE_USB_HDMI_EXT_PCIEX2_mPCIeX2 (R161.1), BMC (D28.59)
mPCIE_GMAC1.mPCIE_GMAC1_RXCLK: CPU_PCIE_USB_HDMI_EXT_PCIEX2_mPCIeX2 (X17.46), CPU_ETH_RGMII1_SW (D46.23)
mPCIE_GMAC1.mPCIE_GMAC1_RXCTL: CPU_PCIE_USB_HDMI_EXT_PCIEX2_mPCIeX2 (X17.41), CPU_ETH_RGMII1_SW (D46.40)
mPCIE_GMAC1.mPCIE_GMAC1_RXD0: CPU_PCIE_USB_HDMI_EXT_PCIEX2_mPCIeX2 (X17.48), CPU_ETH_RGMII1_SW (D46.22)
mPCIE_GMAC1.mPCIE_GMAC1_RXD1: CPU_PCIE_USB_HDMI_EXT_PCIEX2_mPCIeX2 (X17.50), CPU_ETH_RGMII1_SW (D46.21)
mPCIE_GMAC1.mPCIE_GMAC1_RXD2: CPU_PCIE_USB_HDMI_EXT_PCIEX2_mPCIeX2 (X17.52), CPU_ETH_RGMII1_SW (D46.20)
mPCIE_GMAC1.mPCIE_GMAC1_RXD3: CPU_PCIE_USB_HDMI_EXT_PCIEX2_mPCIeX2 (X17.43), CPU_ETH_RGMII1_SW (D46.39)
mPCIE_GMAC1.mPCIE_GMAC1_TXCLK: CPU_PCIE_USB_HDMI_EXT_PCIEX2_mPCIeX2 (X17.44), CPU_ETH_RGMII1_SW (D46.24)
mPCIE_GMAC1.mPCIE_GMAC1_TXCTL: CPU_PCIE_USB_HDMI_EXT_PCIEX2_mPCIeX2 (X17.45), CPU_ETH_RGMII1_SW (D46.29)
mPCIE_GMAC1.mPCIE_GMAC1_TXD0: CPU_PCIE_USB_HDMI_EXT_PCIEX2_mPCIeX2 (X17.42), CPU_ETH_RGMII1_SW (D46.25)
mPCIE_GMAC1.mPCIE_GMAC1_TXD1: CPU_PCIE_USB_HDMI_EXT_PCIEX2_mPCIeX2 (X17.51), CPU_ETH_RGMII1_SW (D46.26)
mPCIE_GMAC1.mPCIE_GMAC1_TXD2: CPU_PCIE_USB_HDMI_EXT_PCIEX2_mPCIeX2 (X17.49), CPU_ETH_RGMII1_SW (D46.27)
mPCIE_GMAC1.mPCIE_GMAC1_TXD3: CPU_PCIE_USB_HDMI_EXT_PCIEX2_mPCIeX2 (X17.47), CPU_ETH_RGMII1_SW (D46.28)
mPCIe_GPIO.SIM_SEL: CPU_GPIO (D2.AK4), INT_mPCIeX2_SIM (D18.2 R132.1 R134.2)
mPCIe_I2C.mPCIe_I2C_SCL: CPU_GPIO (D2.1Y21 R489.1), INT_mPCIeX2_SIM (R131.2)
mPCIe_I2C.mPCIe_I2C_SDA: CPU_GPIO (D2.1Y23 R490.1), INT_mPCIeX2_SIM (R133.2)
MUX_GMAC1_CTRL.SEL1_MUX_GMAC1: BMC (D28.82), CPU_ETH_RGMII1_SW (D46.16 R440.1 R443.1)
MUX_GMAC1_CTRL.SEL2_MUX_GMAC1: BMC (D28.83), CPU_ETH_RGMII1_SW (D46.17 R441.1 R442.1)
PCIe1_Detect: CPU_PCIE_USB_HDMI_EXT_PCIEX2_mPCIeX2 (X18.B11), BMC (D28.55)
PCIE1_PWR_ON: CPU_PCIE_USB_HDMI_EXT_PCIEX2_mPCIeX2 (R159.1), BMC (D28.60)
PCIe2_Detect: CPU_PCIE_USB_HDMI_EXT_PCIEX2_mPCIeX2 (X19.B11), BMC (D28.53)
PCIE2_PWR_ON: CPU_PCIE_USB_HDMI_EXT_PCIEX2_mPCIeX2 (R162.1), BMC (D28.62)
PCIE20_PERSTn: CPU_PCIE_USB_HDMI_EXT_PCIEX2_mPCIeX2 (D21.3), CPU_ETH_RGMII1_SW (D2.1E15)
PCIE_GMAC1.PCIE_GMAC1_RXCLK: CPU_PCIE_USB_HDMI_EXT_PCIEX2_mPCIeX2 (X18.A7), CPU_ETH_RGMII1_SW (D46.32)
PCIE_GMAC1.PCIE_GMAC1_RXCTL: CPU_PCIE_USB_HDMI_EXT_PCIEX2_mPCIeX2 (X18.A9), CPU_ETH_RGMII1_SW (D46.42)
PCIE_GMAC1.PCIE_GMAC1_RXD0: CPU_PCIE_USB_HDMI_EXT_PCIEX2_mPCIeX2 (X18.A8), CPU_ETH_RGMII1_SW (D46.31)
PCIE_GMAC1.PCIE_GMAC1_RXD1: CPU_PCIE_USB_HDMI_EXT_PCIEX2_mPCIeX2 (X18.A11), CPU_ETH_RGMII1_SW (D46.19)
PCIE_GMAC1.PCIE_GMAC1_RXD2: CPU_PCIE_USB_HDMI_EXT_PCIEX2_mPCIeX2 (X18.A12), CPU_ETH_RGMII1_SW (D46.18)
PCIE_GMAC1.PCIE_GMAC1_RXD3: CPU_PCIE_USB_HDMI_EXT_PCIEX2_mPCIeX2 (X18.A10), CPU_ETH_RGMII1_SW (D46.41)
PCIE_GMAC1.PCIE_GMAC1_TXCLK: CPU_PCIE_USB_HDMI_EXT_PCIEX2_mPCIeX2 (X18.A6), CPU_ETH_RGMII1_SW (D46.33)
PCIE_GMAC1.PCIE_GMAC1_TXCTL: CPU_PCIE_USB_HDMI_EXT_PCIEX2_mPCIeX2 (X18.A1), CPU_ETH_RGMII1_SW (D46.38)
PCIE_GMAC1.PCIE_GMAC1_TXD0: CPU_PCIE_USB_HDMI_EXT_PCIEX2_mPCIeX2 (X18.A5), CPU_ETH_RGMII1_SW (D46.34)
PCIE_GMAC1.PCIE_GMAC1_TXD1: CPU_PCIE_USB_HDMI_EXT_PCIEX2_mPCIeX2 (X18.A4), CPU_ETH_RGMII1_SW (D46.35)
PCIE_GMAC1.PCIE_GMAC1_TXD2: CPU_PCIE_USB_HDMI_EXT_PCIEX2_mPCIeX2 (X18.A3), CPU_ETH_RGMII1_SW (D46.36)
PCIE_GMAC1.PCIE_GMAC1_TXD3: CPU_PCIE_USB_HDMI_EXT_PCIEX2_mPCIeX2 (X18.A2), CPU_ETH_RGMII1_SW (D46.37)
PERST#: INT_mPCIeX2_SIM (X7.22), CPU_PCIE_USB_HDMI_EXT_PCIEX2_mPCIeX2 (5 pins)
PHY0_CLKOUT: RGMII0_ETH_PHY (R290.2 R291.1), CPU_ETH_RGMII1_SW (D2.B14)
PHY0_LED0: PWR_PoE_PD_1000BASE-T (R344.1 R348.1), RGMII0_ETH_PHY (D32.32 R317.2 R318.1)
PHY0_LED1: PWR_PoE_PD_1000BASE-T (R346.1 R349.1), RGMII0_ETH_PHY (D32.33 R321.2)
PHY0_LED2: PWR_PoE_PD_1000BASE-T (X26.9), RGMII0_ETH_PHY (D32.34 R319.2 R320.1)
PHY0_MDC: RGMII0_ETH_PHY (D32.13 R288.2), CPU_ETH_RGMII1_SW (D2.1A7)
PHY0_MDI.PHY0_MDI0_N: PWR_PoE_PD_1000BASE-T (D33.3), RGMII0_ETH_PHY (D32.2)
PHY0_MDI.PHY0_MDI0_P: PWR_PoE_PD_1000BASE-T (D33.2), RGMII0_ETH_PHY (D32.1)
PHY0_MDI.PHY0_MDI1_N: PWR_PoE_PD_1000BASE-T (D33.6), RGMII0_ETH_PHY (D32.5)
PHY0_MDI.PHY0_MDI1_P: PWR_PoE_PD_1000BASE-T (D33.5), RGMII0_ETH_PHY (D32.4)
PHY0_MDI.PHY0_MDI2_N: PWR_PoE_PD_1000BASE-T (D33.9), RGMII0_ETH_PHY (D32.7)
PHY0_MDI.PHY0_MDI2_P: PWR_PoE_PD_1000BASE-T (D33.8), RGMII0_ETH_PHY (D32.6)
PHY0_MDI.PHY0_MDI3_N: PWR_PoE_PD_1000BASE-T (D33.12), RGMII0_ETH_PHY (D32.10)
PHY0_MDI.PHY0_MDI3_P: PWR_PoE_PD_1000BASE-T (D33.11), RGMII0_ETH_PHY (D32.9)
PHY0_MDIO: RGMII0_ETH_PHY (D32.14 R287.2), CPU_ETH_RGMII1_SW (D2.A9)
PHY0_RSTn: RGMII0_ETH_PHY (C442.1 D32.12 R286.2), CPU_ETH_RGMII1_SW (D2.1C18)
PMIC_CTRL.PMIC_INT_L: PWR_PMIC (D3.19), CPU_GPIO (D2.1T21)
PMIC_CTRL.PMIC_PWR_CTRL1: PWR_PMIC (D3.62), CPU_GPIO (D2.Y28)
PMIC_CTRL.RESETn: PWR_MAIN (D6.7), PWR_PMIC (C113.2 D3.40), CPU_GPIO (C261.2 D2.W28 R118.1 R119.2)
PMIC_EXT_EN_OUT: PWR_PMIC (D3.39), PWR_CORE (R353.1 R354.1 R359.1 R360.1)
PMIC_PWR_CTRL2: PWR_PMIC (D3.61), PWR_CORE (VT28.1 VT29.1 VT30.1), CPU_GPIO (D2.1T24)
PWM0_CH0_M0_IR: CPU_GPIO (D2.1W22), Peripheral (R491.2)
PWRON_L: PWR_PMIC (R23.1), Peripheral (R410.1)
QSPI_CS: Flash_eMMC_MicroSD (D13.1 R74.1), BMC (D29.10)
QSPI_D0: Flash_eMMC_MicroSD (D13.5), BMC (D29.12)
QSPI_D1: Flash_eMMC_MicroSD (D13.2), BMC (D29.14)
QSPI_D2: Flash_eMMC_MicroSD (D13.3), BMC (D29.15)
QSPI_D3: Flash_eMMC_MicroSD (D13.7), BMC (D29.13)
QSPI_FLASH.QSPI_SCLK: Flash_eMMC_MicroSD (D13.6 VT2.3), BMC (D29.8)
RK628_CTRL.SAI4_LRCK_M0: V-by-One (R454.1 R458.1), CPU_ETH_RGMII1_SW (D2.1B12)
RK628_CTRL.SAI4_SDI_M0: V-by-One (C547.2 D47.H4), CPU_ETH_RGMII1_SW (D2.A21)
RK628_HDMI_RX0_N: V-by-One (R466.1), LVDS_eDP (C533.2 X29.11)
RK628_HDMI_RX0_P: V-by-One (R467.1), LVDS_eDP (C534.2 X29.12)
RK628_HDMI_RX1_N: V-by-One (R464.1), LVDS_eDP (C531.2 X29.8)
RK628_HDMI_RX1_P: V-by-One (R465.1), LVDS_eDP (C532.2 X29.9)
RK628_HDMI_RX2_N: V-by-One (R462.1), LVDS_eDP (C529.2 X29.4)
RK628_HDMI_RX2_P: V-by-One (R463.1), LVDS_eDP (C530.2 X29.5)
RK628_HDMI_RXC_N: V-by-One (R468.1), LVDS_eDP (C527.2 X29.1)
RK628_HDMI_RXC_P: V-by-One (R469.1), LVDS_eDP (C528.2 X29.2)
RK628_HDMIRX_HPD_OUT: V-by-One (R239.1), LVDS_eDP (C574.2 X29.15)
RK628_HDMIRX_PWREN: PWR_CORE (R371.1), CPU_GPIO (D2.Y29)
RK628_I2C_SCL: V-by-One (R459.1), CPU_ETH_RGMII1_SW (D2.1D16 R129.1)
RK628_I2C_SDA: V-by-One (R460.1), CPU_ETH_RGMII1_SW (D2.1B18 R130.1)
RK628_SAI_I2C.SAI4_LRCK_M0: V-by-One (R456.1), CPU_ETH_RGMII1_SW (D2.1B5)
RK628_SAI_I2C.SAI4_SCLK_M0: V-by-One (R457.1), CPU_ETH_RGMII1_SW (D2.1C5)
RK628_SAI_I2C.SAI4_SDI_M0: V-by-One (R451.1), CPU_ETH_RGMII1_SW (D2.1A5)
RTC_32KHZ: PWR_MAIN (R52.2 R53.1), CPU_GPIO (D2.1U23), WIRELESS (R396.1)
RTC_CTRL.RTC_INT#: PWR_MAIN (R54.2 VD9.2), CPU_GPIO (D2.V29)
SARADC.SARADC_VIN0_BOOT: CPU_GPIO (C265.2 D2.A25), Peripheral (R414.2 R417.2 R419.1)
SARADC.SARADC_VIN1_KEY/RECOVERY: CPU_GPIO (C266.2 D2.1A22), Peripheral (R421.2 R422.1)
SARADC.SARADC_VIN2_HW_ID: CPU_GPIO (C575.2 D2.1B19), Peripheral (R409.2 R413.1)
SARADC.SARADC_VIN4_IN: CPU_GPIO (C576.2 D2.1E18), Peripheral (R408.2 R412.1)
SARADC.SARADC_VIN5_BOM_ID: CPU_GPIO (C577.2 D2.1D19), Peripheral (R415.2 R420.1)
SD_DET.SDMMC0_DET: CPU_GPIO (R121.2 R123.2 R125.1), Flash_eMMC_MicroSD (VD11.1 X3.9)
SD_FSPI.SDMMC0_CLK_FSPI1_CLK: CPU_GPIO (D2.1B21), BMC (D31.1)
SD_FSPI.SDMMC0_CMD_FSPI1_CSN: CPU_GPIO (D2.1A21), BMC (D31.3)
SD_FSPI.SDMMC0_D0_FSPI1_D0: CPU_GPIO (D2.B24), BMC (D31.4)
SD_FSPI.SDMMC0_D1_FSPI1_D1: CPU_GPIO (D2.B25), BMC (D31.6)
SD_FSPI.SDMMC0_D2_FSPI1_D2: CPU_GPIO (D2.A23), BMC (D31.7)
SD_FSPI.SDMMC0_D3_FSPI1_D3: CPU_GPIO (D2.B23), BMC (D31.9)
SD_SDIO.SDMMC0_CLK: Flash_eMMC_MicroSD (R77.1), BMC (D31.8)
SD_SDIO.SDMMC0_CMD: Flash_eMMC_MicroSD (R76.1), BMC (D31.10)
SD_SDIO.SDMMC0_D0: Flash_eMMC_MicroSD (R78.1), BMC (D31.12)
SD_SDIO.SDMMC0_D1: Flash_eMMC_MicroSD (R79.1), BMC (D31.14)
SD_SDIO.SDMMC0_D2: Flash_eMMC_MicroSD (R73.1), BMC (D31.15)
SD_SDIO.SDMMC0_D3: Flash_eMMC_MicroSD (R75.1), BMC (D31.13)
SIM1_DET: CPU_GPIO (D2.1AD2), INT_mPCIeX2_SIM (X11.C9)
SIM2_DET: CPU_GPIO (D2.1AA22), INT_mPCIeX2_SIM (X12.C9)
SUPCAP_ON_OFF.VIN_SUPCAP_ON_OFF: PWR_DC_IN (R152.2), BMC (D28.67)
UART0.UART0_RX_M0_mPCIe: CPU_GPIO (R494.1), CPU_PCIE_USB_HDMI_EXT_PCIEX2_mPCIeX2 (X16.3)
UART0.UART0_RX_M0_PCIE1: CPU_GPIO (R498.1), CPU_PCIE_USB_HDMI_EXT_PCIEX2_mPCIeX2 (X18.B13)
UART0.UART0_RX_M0_PCIE2: CPU_GPIO (R502.1), CPU_PCIE_USB_HDMI_EXT_PCIEX2_mPCIeX2 (X19.B13)
UART0.UART0_TX_M0_mPCIe: CPU_GPIO (R493.1), CPU_PCIE_USB_HDMI_EXT_PCIEX2_mPCIeX2 (X16.1)
UART0.UART0_TX_M0_PCIE1: CPU_GPIO (R495.1), CPU_PCIE_USB_HDMI_EXT_PCIEX2_mPCIeX2 (X18.B12)
UART0.UART0_TX_M0_PCIE2: CPU_GPIO (R499.1), CPU_PCIE_USB_HDMI_EXT_PCIEX2_mPCIeX2 (X19.B12)
USB2_HOST1_D_N: CPU_PCIE_USB_HDMI_EXT_PCIEX2_mPCIeX2 (D2.2T5), USB (D16.10)
USB2_HOST1_D_P: CPU_PCIE_USB_HDMI_EXT_PCIEX2_mPCIeX2 (D2.2T4), USB (D16.11)
USB2_mPCIe.USB2_mPCIe1_D_N: INT_mPCIeX2_SIM (X7.36), USB (D16.1)
USB2_mPCIe.USB2_mPCIe1_D_P: INT_mPCIeX2_SIM (X7.38), USB (D16.2)
USB2_mPCIe.USB2_mPCIe2_D_N: INT_mPCIeX2_SIM (X8.36), USB (D16.3)
USB2_mPCIe.USB2_mPCIe2_D_P: INT_mPCIeX2_SIM (X8.38), USB (D16.4)
USB2_OTG0_D_N: CPU_PCIE_USB_HDMI_EXT_PCIEX2_mPCIeX2 (D2.AL9), USB (R89.2)
USB2_OTG0_D_P: CPU_PCIE_USB_HDMI_EXT_PCIEX2_mPCIeX2 (D2.AK9), USB (R90.2)
USB2_OTG0_VBUSDET: CPU_PCIE_USB_HDMI_EXT_PCIEX2_mPCIeX2 (D2.2P3), USB (R93.1 R94.1)
USB3_OTG0.USB3_OTG0_SS_RX1_N: CPU_PCIE_USB_HDMI_EXT_PCIEX2_mPCIeX2 (D2.AL10), USB (VD18.1 X5.5)
USB3_OTG0.USB3_OTG0_SS_RX1_P: CPU_PCIE_USB_HDMI_EXT_PCIEX2_mPCIeX2 (D2.AK10), USB (VD19.1 X5.6)
USB3_OTG0.USB3_OTG0_SS_TX1_N: CPU_PCIE_USB_HDMI_EXT_PCIEX2_mPCIeX2 (D2.AK11), USB (C234.1)
USB3_OTG0.USB3_OTG0_SS_TX1_P: CPU_PCIE_USB_HDMI_EXT_PCIEX2_mPCIeX2 (D2.AL11), USB (C235.1)
USB_OTG0_PWREN_H: CPU_GPIO (D2.AL3), USB (D15.4 R92.1)
USB_PCIE.USB_PCIE1_D_N: CPU_PCIE_USB_HDMI_EXT_PCIEX2_mPCIeX2 (D42.2), USB (D16.5)
USB_PCIE.USB_PCIE1_D_P: CPU_PCIE_USB_HDMI_EXT_PCIEX2_mPCIeX2 (D42.1), USB (D16.6)
USB_PCIE.USB_PCIE2_D_N: CPU_PCIE_USB_HDMI_EXT_PCIEX2_mPCIeX2 (X19.B5), USB (D16.7)
USB_PCIE.USB_PCIE2_D_P: CPU_PCIE_USB_HDMI_EXT_PCIEX2_mPCIeX2 (X19.B6), USB (D16.8)
USB_SEL: CPU_PCIE_USB_HDMI_EXT_PCIEX2_mPCIeX2 (D42.10 R438.1), BMC (D28.84)
WAKE_BT: WIRELESS (R398.1), CPU_ETH_RGMII1_SW (D2.1E21)
WDT_CTRL.WDT_EN: PWR_MAIN (D6.5 R43.2), CPU_GPIO (D2.1Y24)
WDT_CTRL.WDT_WDI: PWR_MAIN (D6.6), CPU_GPIO (D2.1W21)
WL_BT_CTRL.WL_EN: WIRELESS (A2.12 R386.2 R387.1), CPU_ETH_RGMII1_SW (D2.A26)
WL_BT_WAKE.WL_HOST_WAKE: CPU_GPIO (D2.1U22), WIRELESS (A2.13)
WL_SDIO.WL_SDIO_CLK: WIRELESS (A2.17), CPU_ETH_RGMII1_SW (D2.1B22)
WL_SDIO.WL_SDIO_CMD: WIRELESS (A2.16 R389.2), CPU_ETH_RGMII1_SW (D2.B26)
WL_SDIO.WL_SDIO_D0: WIRELESS (A2.18 R394.2), CPU_ETH_RGMII1_SW (D2.A28)
WL_SDIO.WL_SDIO_D1: WIRELESS (A2.19 R392.2), CPU_ETH_RGMII1_SW (D2.B27)
WL_SDIO.WL_SDIO_D2: WIRELESS (A2.14 R391.2), CPU_ETH_RGMII1_SW (D2.1A23)
WL_SDIO.WL_SDIO_D3: WIRELESS (A2.15 R390.2), CPU_ETH_RGMII1_SW (D2.A27)

## Assembly variants
MU-RK3576J-MB_ВКС: not fitted A1 A2 BQ1 BQ5 BQ6 BQ8 C3 C6 C7 C9 C10 C13 C17 C23 C64 C158 C200 C203 C225 C226 C267 C268 C269 C270 C271 C272 C273 C274 C275 C276 C277 C278 C279 C280 C281 C282 C283 C284 C285 C286 C287 C288 C289 C290 C291 C292 C293 C294 C295 C296 C297 C308 C309 C310 C311 C312 C313 C314 C315 C319 C321 C329 C330 C331 C332 C333 C334 C335 C339 C340 C341 C342 C343 C344 C345 C348 C349 C350 C353 C361 C362 C363 C364 C365 C366 C367 C370 C371 C372 C373 C374 C375 C377 C378 C379 C380 C381 C382 C383 C384 C385 C386 C387 C388 C389 C390 C391 C392 C393 C395 C396 C397 C398 C399 C420 C421 C422 C423 C424 C425 C426 C427 C428 C429 C430 C431 C432 C433 C434 C438 C455 C456 C457 C458 C459 C460 C461 C462 C463 C464 C465 C466 C468 C469 C470 C471 C472 C473 C474 C475 C521 C522 C523 C524 C525 C526 C535 C536 C537 C538 C539 C540 C541 C560 C561 C562 C563 C580 C581 C582 C583 C585 C586 C638 C641 D9 D18 D19 D20 D21 D23 D25 D28 D34 D42 D43 D44 D45 D46 HL10 L15 L16 L17 L18 L19 L20 L21 L26 L27 L35 R10 R29 R30 R31 R32 R38 R45 R46 R49 R54 R57 R60 R72 R73 R75 R76 R77 R78 R79 R88 R131 R132 R133 R134 R135 R136 R137 R138 R139 R140 R141 R142 R143 R144 R145 R146 R147 R148 R149 R150 R151 R152 R153 R154 R155 R158 R159 R160 R161 R162 R163 R166 R170 R171 R172 R173 R176 R177 R178 R179 R180 R181 R182 R183 R184 R185 R186 R187 R188 R190 R192 R193 R194 R195 R196 R197 R198 R199 R200 R201 R202 R203 R204 R205 R206 R207 R208 R209 R210 R211 R212 R213 R214 R215 R216 R217 R218 R219 R220 R221 R222 R223 R224 R225 R226 R227 R228 R229 R230 R231 R232 R234 R236 R237 R239 R241 R242 R243 R245 R246 R247 R248 R249 R250 R251 R252 R253 R254 R255 R256 R257 R258 R259 R267 R268 R269 R270 R271 R272 R273 R274 R275 R276 R277 R278 R279 R280 R281 R286 R288 R295 R299 R306 R308 R312 R318 R319 R323 R324 R325 R326 R327 R329 R331 R332 R334 R335 R337 R338 R339 R340 R341 R342 R343 R344 R349 R374 R375 R376 R377 R378 R379 R380 R381 R382 R383 R384 R385 R386 R387 R388 R389 R390 R391 R392 R393 R394 R395 R396 R397 R398 R399 R400 R401 R402 R403 R404 R405 R406 R407 R410 R411 R416 R424 R425 R426 R427 R428 R429 R430 R431 R432 R433 R434 R435 R436 R437 R438 R439 R440 R441 R442 R443 R447 R472 R477 R479 R481 R482 R483 R484 R485 R503 R662 R663 R664 R665 R666 R667 RV1 RV2 S1 S2 TP9 TP10 TP11 TP12 V86 VD11 VD12 VD13 VD14 VD15 VD16 VD17 VD29 VD30 VD31 VD32 VD33 VD34 VD35 VD36 VD37 VD38 VD39 VD40 VD41 VD42 VD44 VD45 VD46 VD47 VD48 VD49 VD50 VD51 VT7 VT8 VT9 VT12 VT13 VT14 VT15 VT16 VT17 VT18 VT21 VT22 VT25 VT26 VT31 VT32 VT33 VT84 VT85 X3 X7 X8 X9 X10 X11 X12 X13 X14 X15 X18 X19 X20 X21 X24 X27 X28 X29 X30 X31 X33 X34 X35 X36
MU-RK3576J-MB_MEDIAPLAYER: not fitted A1 BQ2 BQ5 BQ6 BQ8 C64 C156 C157 C200 C203 C267 C268 C269 C270 C271 C272 C273 C274 C275 C276 C277 C278 C279 C280 C281 C282 C283 C288 C289 C290 C291 C292 C293 C294 C295 C296 C297 C308 C309 C310 C311 C312 C313 C314 C315 C319 C321 C329 C330 C331 C332 C333 C334 C335 C339 C340 C341 C342 C343 C344 C345 C420 C421 C422 C423 C424 C425 C426 C427 C428 C429 C430 C431 C432 C433 C434 C438 C521 C522 C535 C536 C537 C538 C539 C540 C541 C560 C561 C562 C563 C580 C581 C582 C583 C585 C586 C590 C591 C592 C638 C641 D9 D18 D19 D20 D21 D28 D42 D43 D44 D45 D46 HL10 L15 L16 L35 R10 R31 R32 R38 R45 R46 R49 R54 R57 R60 R72 R88 R131 R132 R133 R134 R135 R136 R137 R138 R139 R140 R141 R142 R143 R144 R145 R146 R147 R148 R149 R150 R151 R152 R153 R154 R155 R156 R157 R158 R159 R160 R161 R162 R163 R164 R165 R166 R170 R171 R172 R173 R176 R177 R178 R179 R180 R181 R182 R183 R184 R185 R186 R187 R188 R190 R192 R193 R232 R234 R239 R241 R242 R243 R245 R246 R247 R248 R249 R250 R251 R252 R253 R254 R255 R256 R257 R258 R259 R267 R268 R269 R270 R271 R272 R273 R274 R275 R276 R277 R278 R279 R280 R281 R286 R288 R295 R299 R306 R308 R312 R318 R319 R344 R349 R374 R375 R376 R377 R378 R379 R380 R381 R382 R383 R384 R385 R387 R393 R401 R402 R404 R405 R406 R410 R411 R416 R424 R425 R426 R427 R428 R429 R430 R431 R432 R433 R434 R435 R436 R437 R438 R439 R440 R441 R442 R443 R447 R472 R477 R482 R483 R486 R487 R492 R503 R662 R663 R664 R665 R666 R667 RV1 RV2 S1 S2 TP9 TP10 TP11 TP12 V86 VD29 VD30 VD31 VD32 VD33 VD34 VD35 VD36 VD37 VD38 VD39 VD40 VD41 VD44 VD45 VT7 VT8 VT12 VT13 VT14 VT15 VT16 VT17 VT18 VT19 VT20 VT21 VT22 VT23 VT24 VT25 VT31 VT32 VT84 VT85 X7 X8 X9 X10 X11 X12 X13 X14 X15 X16 X17 X18 X19 X27 X29 X30 X31 X35 X36 X38 X39 X40
MU-RK3576J-MB_FULL: not fitted BQ2 BQ3 C64 C156 C157 C203 C204 R5 R10 R31 R32 R38 R45 R46 R49 R54 R57 R60 R72 R88 R170 R171 R172 R173 R176 R181 R183 R185 R186 R187 R188 R232 R233 R235 R239 R241 R242 R265 R283 R286 R288 R295 R299 R306 R308 R312 R318 R319 R344 R349 R374 R375 R376 R377 R378 R379 R380 R382 R383 R387 R393 R401 R402 R405 R406 R441 R443 R447 R482 R483